# Altium schematic sheet Current Sensor.SchDoc: Current Sensor Board
size Letter; DrawnBy: N. Chapman, A. Ebrahim, K. Hong; Organization: UW Robotics; Address1: 200 University Avenue; Address2: Waterloo; Address3: Ontario; Address4: Canada N2L 3G6; Revision: A; SheetNumber: 1; SheetTotal: 1
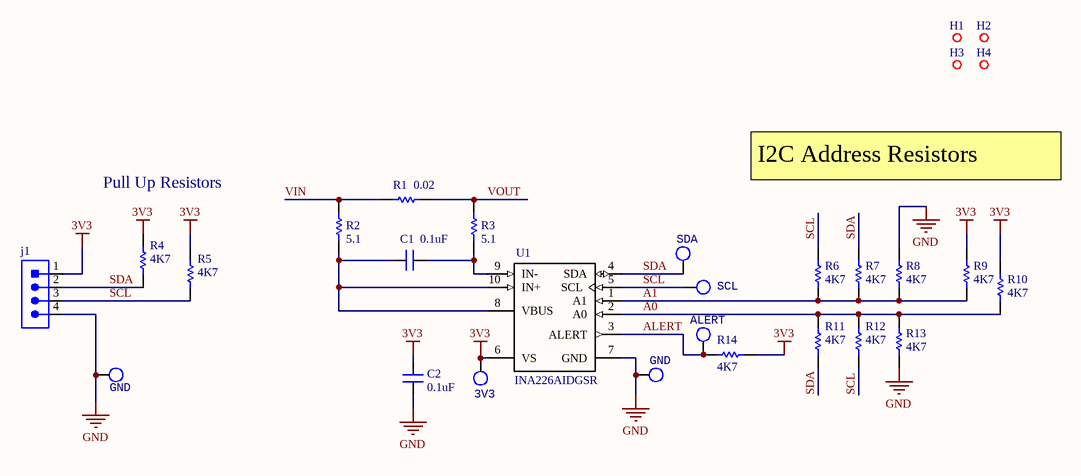
[diagram p0: Current Sensor.SchDoc]

## Parts
C1  value 0.1uF  [CAPC2012X140N]  (hidden comment: CAP_0.1uF_50V_0805)
C2  value 0.1uF  [CAPC2012X140N]  (hidden comment: CAP_0.1uF_50V_0805)
H1  MOUNTING_HOLES  [MOUNTING_HOLE]  (value not drawn)
H2  MOUNTING_HOLES  [MOUNTING_HOLE]  (value not drawn)
H3  MOUNTING_HOLES  [MOUNTING_HOLE]  (value not drawn)
H4  MOUNTING_HOLES  [MOUNTING_HOLE]  (value not drawn)
j1  CON_4M_TERM  [1935187]  (value not drawn)
R1  value 0.02  [RESC6532X75N]  (hidden comment: RES_20m_2512)
R2  value 5.1  [RESC2013X70X40LL20T20]  (hidden comment: RES_5.1_0805)
R3  value 5.1  [RESC2013X70X40LL20T20]  (hidden comment: RES_5.1_0805)
R4  value 4K7  [RESC2012X60N]  (hidden comment: RES_4K7_0805)
R5  value 4K7  [RESC2012X60N]  (hidden comment: RES_4K7_0805)
R6  value 4K7  [RESC2012X60N]  (hidden comment: RES_4K7_0805)
R7  value 4K7  [RESC2012X60N]  (hidden comment: RES_4K7_0805)
R8  value 4K7  [RESC2012X60N]  (hidden comment: RES_4K7_0805)
R9  value 4K7  [RESC2012X60N]  (hidden comment: RES_4K7_0805)
R10  value 4K7  [RESC2012X60N]  (hidden comment: RES_4K7_0805)
R11  value 4K7  [RESC2012X60N]  (hidden comment: RES_4K7_0805)
R12  value 4K7  [RESC2012X60N]  (hidden comment: RES_4K7_0805)
R13  value 4K7  [RESC2012X60N]  (hidden comment: RES_4K7_0805)
R14  value 4K7  [RESC2012X60N]  (hidden comment: RES_4K7_0805)
TP1  SDA  [TESTPOINT_LOOP]
TP2  SCL  [TESTPOINT_LOOP]
TP3  ALERT  [TESTPOINT_LOOP]
TP4  GND  [TESTPOINT_LOOP]
TP5  3V3  [TESTPOINT_LOOP]
TP6  GND  [TESTPOINT_LOOP]
U1  INA226AIDGSR  [INA226AIDGSR]

## Nets
3V3: C2.2 j1.1 R4.1 R5.1 R9.2 R10.2 R14.2 TP5.1 U1.6(VS)
GND: C2.1 j1.4 R8.2 R13.2 TP4.1 TP6.1 U1.7(GND)
A0: R10.1 R11.1 R12.1 R13.1 U1.2(A0)
A1: R6.1 R7.1 R8.1 R9.1 U1.1(A1)
ALERT: R14.1 TP3.1 U1.3(ALERT)
SCL: j1.3 R5.2 R6.2 R12.2 TP2.1 U1.5(SCL)
SDA: j1.2 R4.2 R7.2 R11.2 TP1.1 U1.4(SDA)
VIN: R1.1 R2.2
VOUT: R1.2 R3.2
NetC1_1: C1.1 R2.1 U1.8(VBUS) U1.10(IN+)
NetC1_2: C1.2 R3.1 U1.9(IN-)

## Notes on the sheet
- Pull Up Resistors
- I2C Address Resistors
- Title
- Size:
- Date:
- Letter
- Drawn By:
- Sheet
- of
- File:

## Library data of the parts
C1 C2 = CAP_0.1uF_50V_0805: CAP CER 0.1UF 50V X7R 0805; Manufacturer 1: Murata; Manufacturer Part Number 1: GCD21BR71H104KA01L; Capacitance: 100nF; Tolerance: 10%; Supplier 1: Digi-Key; Mount: Surface Mount; Case/Package: 0805; Case Code (Metric): 2012; Case Code (Imperial): 0805; Min Operating Temperature: -55°C; Max Operating Temperature: 125°C; Voltage Rating: 50V; Dielectric: X7R; Termination: SMD/SMT; Length: 2mm; Height: 1.25mm; Width: 0.049inch; Thickness: 0.049inch; Depth: 1.25mm; Ratings: AEC-Q200; ComponentLink1URL: https://datasheet.ciiva.com/29537/c03e-29537701.pdf?src-supplier=Digi-Key; ComponentLink1Description: https://datasheet.ciiva.com/29537/c03e-29537701.pdf?src-supplier=Digi-Key; Supplier Part Number 1: 490-11955-1-ND
H1-H4 = MOUNTING_HOLES: 6cm x 6cm
j1 = CON_4M_TERM: TERM BLK 4POS SIDE ENTRY 5MM PCB; Manufacturer 1: Phoenix Contact; Current: 18A; Voltage: 300V; Wire Gauge: 12-26AWG; Wire Termination: Screw; Screw Thread: M2.6; Manufacturer Part Number 1: 1935187; Supplier Part Number 1: 277-1579-ND; Supplier 1: Digi-Key; Pitch: 5mm; Mounting Type: Through Hole
R1 = RES_20m_2512: RES 0.02 OHM 1% 3W 2512; Manufacturer 1: Riedon; Manufacturer Part Number 1: CSRL3-0R02F8; Supplier 1: Digi-Key; Pricing 1: 1=0.66000, 10=0.47400, 25=0.36920, 50=0.31260, 100=0.24620, 250=0.20836, 500=0.17048, 1000=0.13259 (USD); RoHS: No; Supplier Part Number 1: 696-1840-1-ND
R2 R3 = RES_5.1_0805: RES SMD 5.1 OHM 5% 1/8W 0805; Part Number: ERJ-6GEYJ5R1V; Manufacturer: Panasonic; Supplier 1: Digi-Key; Supplier Part Number 1: P5.1ACT-ND
R4-R14 = RES_4K7_0805: RES SMD 4.7K OHM 5% 1/8W 0805; Manufacturer 1: Yageo; Manufacturer Part Number 1: RC0805JR-074K7L; Resistance: 4.7kR; Temperature Coefficient: 100ppm/°C; Power Rating: 125mW; Voltage Rating: 150V; Supplier 1: Digi-Key; Stock 1: 2755291; Pricing 1: 1=0.10000, 10=0.03500, 100=0.01400, 1000=0.00631, 2500=0.00548 (USD); RoHS: Yes; Case/Package: Molded; Contact Plating: Tin,Lead,Matte; Case Code (Imperial): 0805; Case Code (Metric): 2012; Min Operating Temperature: -55°C; Max Operating Temperature: 155°C; Tolerance: 5%; Packaging: Tape and Reel; Composition: Thick Film; Termination: SMD/SMT; Military Standard: Not; Length: 2mm; Depth: 1.25mm; Radiation Hardening: No; REACH SVHC: Unknown; Lead Free: Lead Free; ComponentLink1URL: https://datasheet.ciiva.com/7941/442941-7941973.pdf?src-supplier=Element14; ComponentLink1Description: https://datasheet.ciiva.com/7941/442941-7941973.pdf?src-supplier=Element14; ComponentLink2URL: https://datasheet.ciiva.com/7941/442941-7941974.pdf?src-supplier=Element14; ComponentLink2Description: https://datasheet.ciiva.com/7941/442941-7941974.pdf?src-supplier=Element14; ComponentLink3URL: https://datasheet.ciiva.com/17486/rc0805-17486827.pdf?src-supplier=Future+Electronics; ComponentLink3Description: https://datasheet.ciiva.com/17486/rc0805-17486827.pdf?src-supplier=Future+Electronics; ComponentLink4URL: https://datasheet.ciiva.com/12667/rc0805-12667037.pdf?src-supplier=Mouser; ComponentLink4Description: https://datasheet.ciiva.com/12667/rc0805-12667037.pdf?src-supplier=Mouser; Supplier Part Number 1: 311-4.7KARCT-ND
TP1-TP5 = TESTPOINT_LOOP: Loop testpoint through-hole pad; Manufacturer: Keystone Electronics; Manufacturer Part Number 1: 5002; Supplier Part Number 1: 36-5002-ND; Supplier 1: Digi-Key
TP6 = TESTPOINT_LOOP: Loop testpoint through-hole pad; Manufacturer 1: Keystone Electronics; Manufacturer Part Number 1: 5002; Supplier Part Number 1: 36-5002-ND; Supplier 1: Digi-Key; Mount: Through Hole
U1 = INA226AIDGSR: IC MONITOR PWR/CURR BIDIR 10MSOP; MF: Texas Instruments; Availability: Unavailable; Package: MSOP-10 Texas Instruments; Price: None; SnapEDA_Link: https://www.snapeda.com/parts/INA226AIDGSR/Texas%20Instruments/view-part/53552/?ref=snap; MP: INA226AIDGSR; Supplier 1: Digi-Key; Supplier Part Number 1: 296-29034-6-ND